# EasyEDA Pro project eLight.eprj

# Schematic SCH
Create Date: 2023-01-14; Page Name: P1; Project Name: FlashLight; Schematic Name: Schematic1; Update Date: 2023-02-02; Company: 嘉立创EDA; Page Size: A4; Version: V1.0
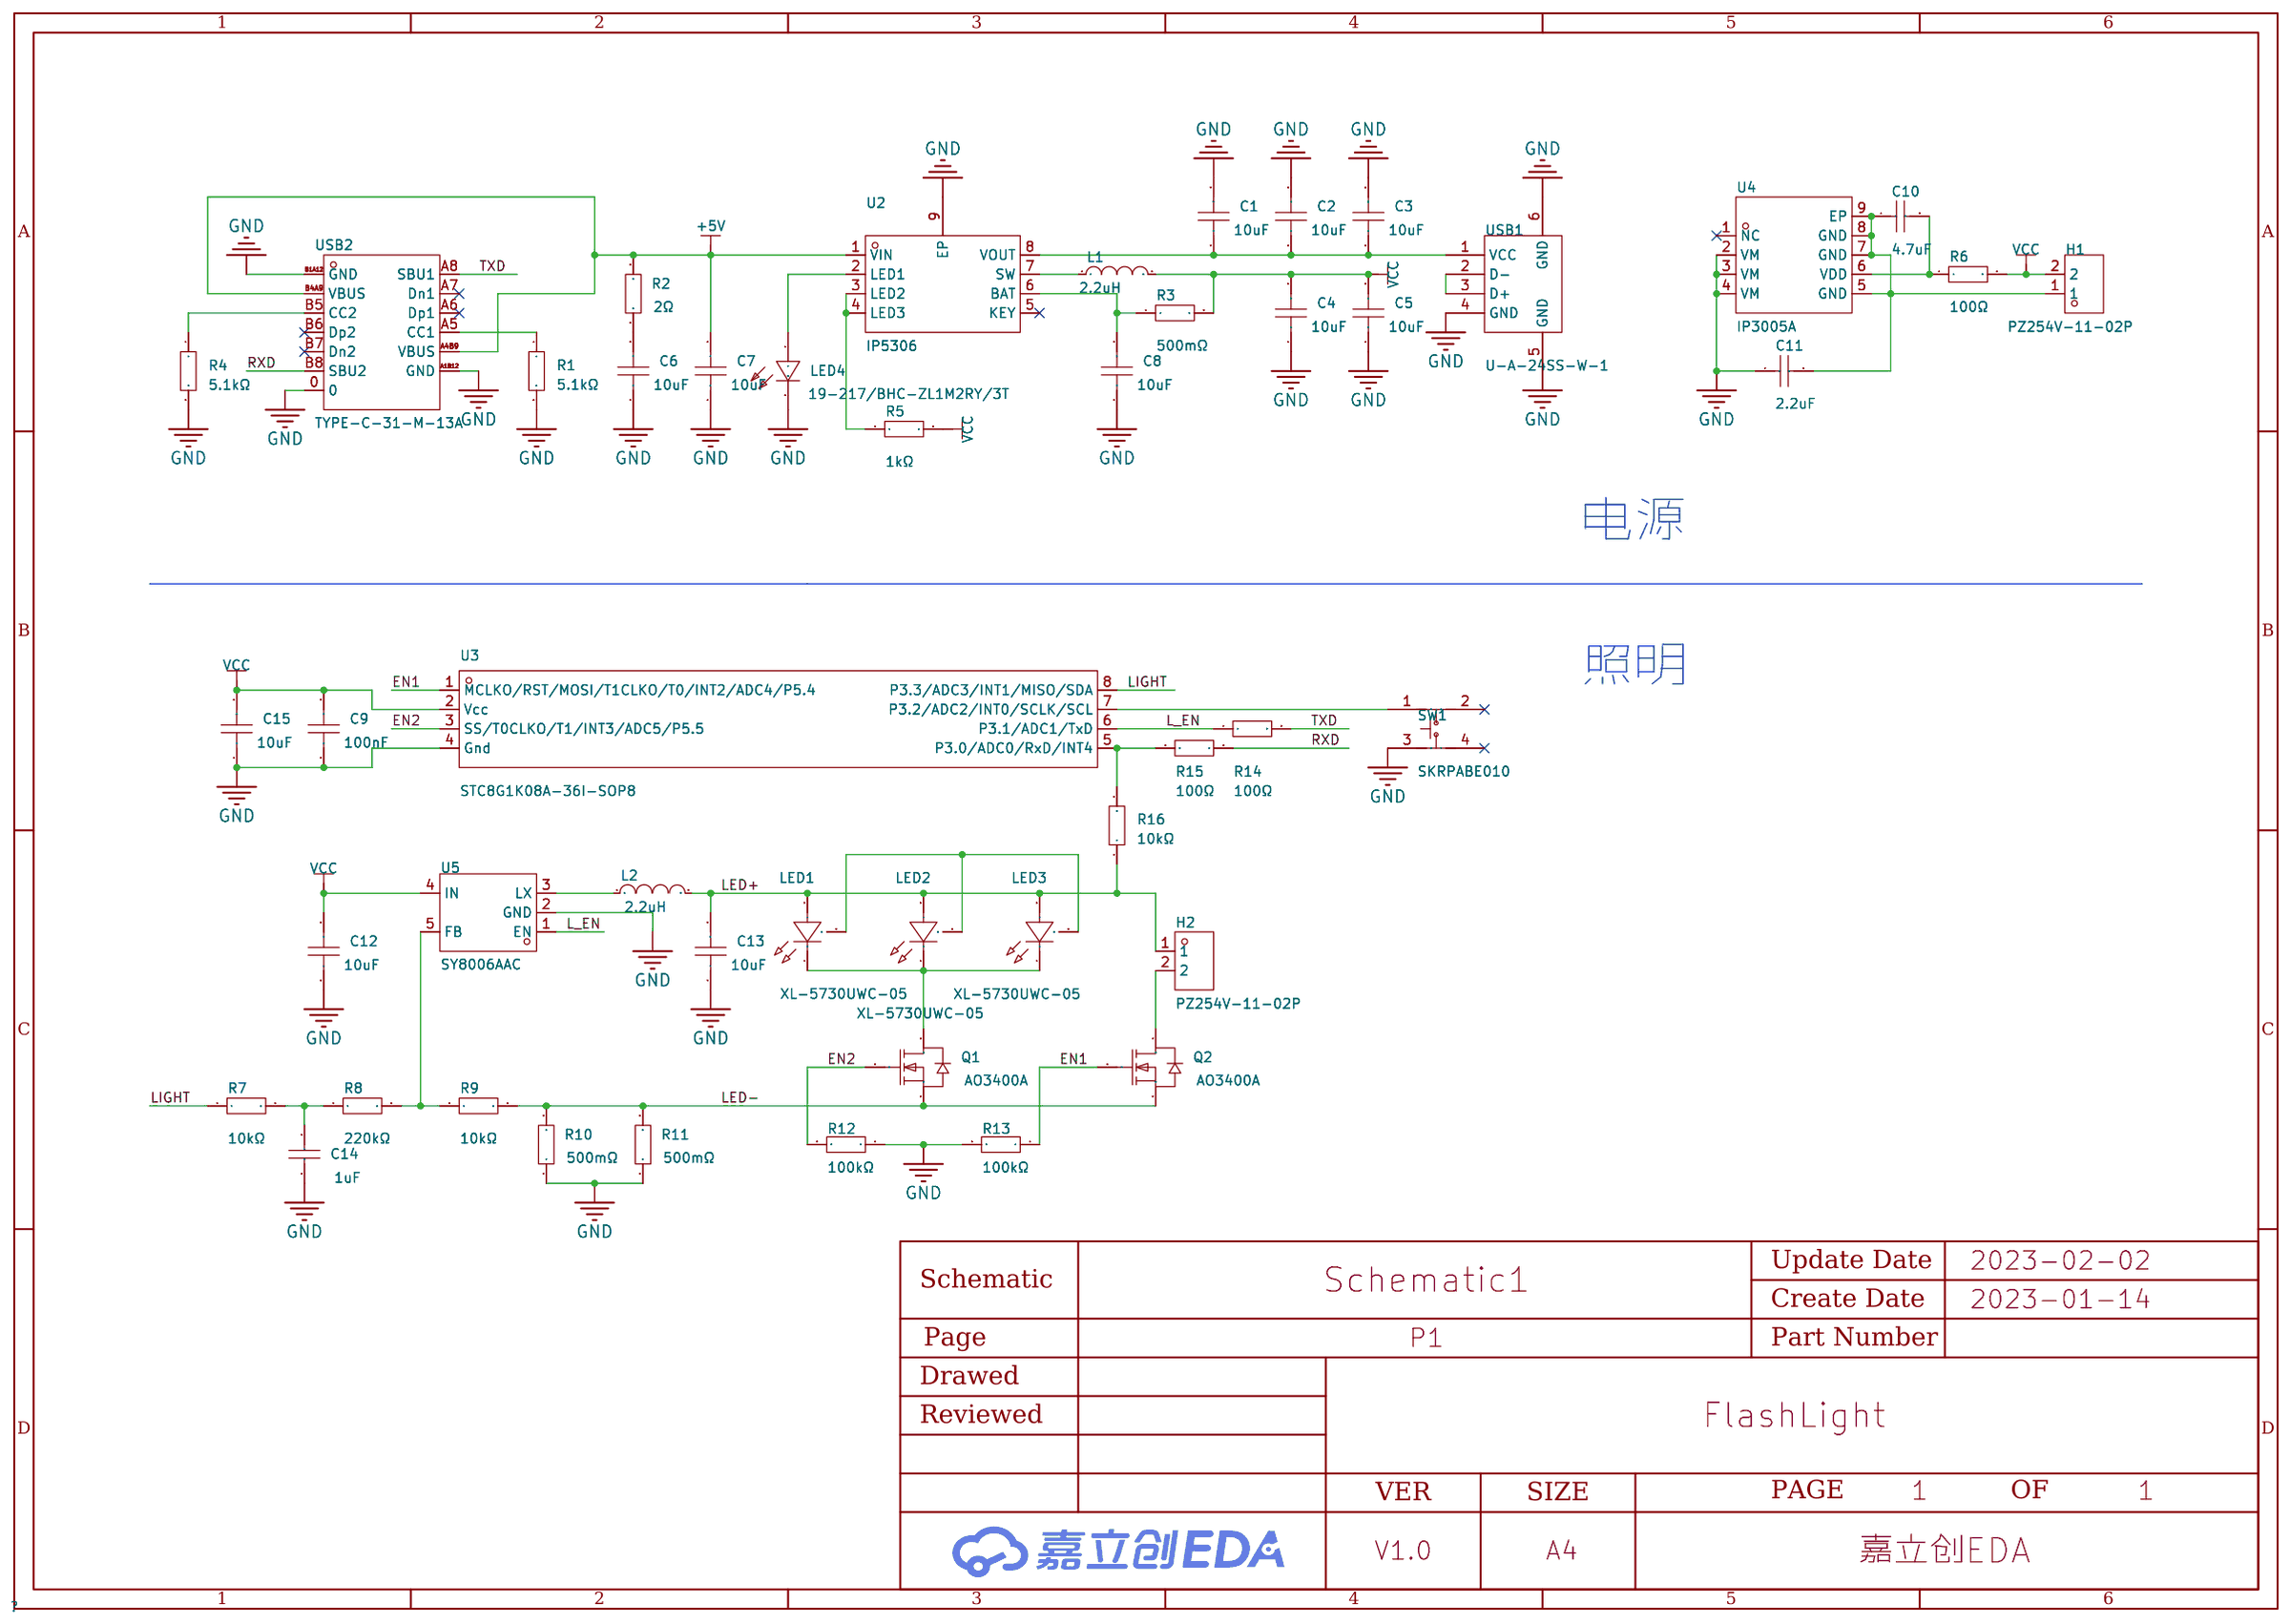
[diagram p0: schematic sheet]

## Parts
C1  10uF  [C0603]
C2  10uF  [C0603]
C3  10uF  [C0603]
C4  10uF  [C0603]
C5  10uF  [C0603]
C6  10uF  [C0603]
C7  10uF  [C0603]
C8  10uF  [C0603]
C9  100nF  [C0603]
C10  4.7uF  [C0603]
C11  2.2uF  [C0603]
C12  10uF  [C0603]
C13  10uF  [C0603]
C14  1uF  [C0603]
C15  10uF  [C0603]
H1  PZ254V-11-02P  [HDR-TH_2P-P2.54-V-M]  (no BOM)
H2  PZ254V-11-02P  [HDR-TH_2P-P2.54-V-M]  (no BOM)
L1  2.2uH  [IND-SMD_L7.3-W6.6]
L2  2.2uH  [IND-SMD_L4.5-W4.0-1]
LED1  XL-5730UWC-05  [LED-SMD_3P-L5.7-W3.0-RD]
LED2  XL-5730UWC-05  [LED-SMD_3P-L5.7-W3.0-RD]
LED3  XL-5730UWC-05  [LED-SMD_3P-L5.7-W3.0-RD]
LED4  19-217/BHC-ZL1M2RY/3T  [LED0603-R-RD_BLUE]
Q1  AO3400A  [SOT-23-3_L2.9-W1.6-P1.90-LS2.8-BR]
Q2  AO3400A  [SOT-23-3_L2.9-W1.6-P1.90-LS2.8-BR]
R1  5.1kΩ  [R0603]
R2  2Ω  [R0603]
R3  500mΩ  [R0603]
R4  5.1kΩ  [R0603]
R5  1kΩ  [R0603]
R6  100Ω  [R0603]
R7  10kΩ  [R0603]
R8  220kΩ  [R0603]
R9  10kΩ  [R0603]
R10  500mΩ  [R0805]
R11  500mΩ  [R0805]
R12  100kΩ  [R0603]
R13  100kΩ  [R0603]
R14  100Ω  [R0603]
R15  100Ω  [R0603]
R16  10kΩ  [R0603]
SW1  SKRPABE010  [KEY-SMD_4P-L4.2-W3.2-P2.20-LS4.6]
U2  IP5306  [ESOP-8_L4.9-W3.9-P1.27-LS6.0-BL-EP]
U3  STC8G1K08A-36I-SOP8  [SOP-8_L5.0-W4.0-P1.27-LS6.0-BL]
U4  IP3005A  [ESOP-8_L4.9-W3.9-P1.27-LS6.0-BL-EP]
U5  SY8006AAC  [SOT-23-5_L3.0-W1.6-P0.95-LS2.8-BR]
USB1  U-A-24SS-W-1  [USB-A-SMD_U-A-24SS-W-1]
USB2  TYPE-C-31-M-13A  [USB-C-SMD_TYPE-C-31-M-13A-1]

## Library data of the parts
C1-C8 C12 C13 C15 = CL10A106KP8NNNC: 容值:10uF;精度:±10%;额定电压:10V;材质(温度系数):X5R;; LCSC Part Name: 10uF ±10% 10V; Supplier Part: C19702; Manufacturer: SAMSUNG(三星); Supplier Footprint: 0603; JLCPCB Part Class: Basic Part; Datasheet: https://atta.szlcsc.com/upload/public/pdf/source/20160103/1457707703378.pdf; Supplier: LCSC; Tolerance: ±10%; Voltage Rated: 10V; Temperature Coefficient: X5R
C9 = CC0603KRX7R9BB104: 容值:100nF;精度:±10%;额定电压:50V;材质(温度系数):X7R;; LCSC Part Name: 100nF ±10% 50V; Supplier Part: C14663; Manufacturer: YAGEO(国巨); Supplier Footprint: 0603; JLCPCB Part Class: Basic Part; Datasheet: https://atta.szlcsc.com/upload/public/pdf/source/20170116/1484561234239.pdf; Supplier: LCSC; Tolerance: ±10%; Voltage Rated: 50V; Temperature Coefficient: X7R
C10 = CL10A475KO8NNNC: 容值:4.7uF;精度:±10%;额定电压:16V;材质(温度系数):X5R;; LCSC Part Name: 4.7uF ±10% 16V; Supplier Part: C19666; Manufacturer: SAMSUNG(三星); Supplier Footprint: 0603; JLCPCB Part Class: Basic Part; Datasheet: https://atta.szlcsc.com/upload/public/pdf/source/20160103/1457707703134.pdf; Supplier: LCSC; Tolerance: ±10%; Voltage Rated: 16V; Temperature Coefficient: X5R
C11 = CL10A225KO8NNNC: 容值:2.2uF;精度:±10%;额定电压:16V;材质(温度系数):X5R;; LCSC Part Name: 2.2uF ±10% 16V; Supplier Part: C23630; Manufacturer: SAMSUNG(三星); Supplier Footprint: 0603; JLCPCB Part Class: Basic Part; Datasheet: https://atta.szlcsc.com/upload/public/pdf/source/20160103/1457707709512.pdf; Supplier: LCSC; Tolerance: ±10%; Voltage Rated: 16V; Temperature Coefficient: X5R
C14 = CL10A105KB8NNNC: 容值:1uF;精度:±10%;额定电压:50V;材质(温度系数):X5R;; LCSC Part Name: 1uF ±10% 50V; Supplier Part: C15849; Manufacturer: SAMSUNG(三星); Supplier Footprint: 0603; JLCPCB Part Class: Basic Part; Datasheet: https://atta.szlcsc.com/upload/public/pdf/source/20160103/1457707679084.pdf; Supplier: LCSC; Tolerance: ±10%; Voltage Rated: 50V; Temperature Coefficient: X5R
H1 H2 = PZ254V-11-02P: 排数:单排;总PIN位数:2;间距:2.54mm;插针结构:1x2P;行距:-;安装类型:直插;圆针/方针:方针;额定电流:-;额定电压:-;配合针长度:6mm;塑高:2.5mm;端接针长度:3mm;触头材质:黄铜;触头镀层:-;工作温度范围:-40℃~+105℃;颜色:黑色;; LCSC Part Name: 2.54mm 1x2P 直插 方针; Supplier Part: C492401; Manufacturer: XFCN(兴飞); Supplier Footprint: 直插,P=2.54mm; JLCPCB Part Class: Extended Part; Datasheet: https://atta.szlcsc.com/upload/public/pdf/source/20200309/C492401_A812433581A9B211A7FFA413ADDFF0E5.pdf; Supplier: LCSC; Number of Rows: 单排; Number of Pins: 2; Pitch: 2.54mm; Pin Structure: 1x2P; Mounting Type: 直插; Circluar Pins/Square Pins: 方针; Length of Mating Pin: 6mm; Insulation Height: 2.5mm; Length of End Connection Pin: 3mm; Contact Material: 黄铜; Operating Temperature Range: -40℃~+105℃; Color: 黑色
L1 = MCS0630-2R2MPY1: 电感值:2.2uH;精度:±20%;额定电流:8A;饱和电流(Isat):12A;直流电阻(DCR):17mΩ;; LCSC Part Name: 2.2uH ±20% 8A 17mΩ; Supplier Part: C2937096; Manufacturer: PSA(信昌电陶); Supplier Footprint: 0630; JLCPCB Part Class: Extended Part; Datasheet: https://atta.szlcsc.com/upload/public/pdf/source/20220121/EA6E6E6F70ED7BAE67EC293805EAAACB.pdf; Supplier: LCSC; Tolerance: ±20%; Rated Current: 8A; Saturation Current (Isat): 12A; DC Resistance (DCR): 17mΩ
L2 = MCS0420-2R2MN2: 电感值:2.2uH;精度:±20%;额定电流:3A;直流电阻(DCR):52mΩ;; LCSC Part Name: 2.2uH ±20% 3A 52mΩ; Supplier Part: C442397; Manufacturer: PSA(信昌电陶); Supplier Footprint: SMD,4x4.6x2mm; JLCPCB Part Class: Extended Part; Supplier: LCSC; Tolerance: ±20%; Rated Current: 3A; DC Resistance (DCR): 52mΩ
LED1-LED3 = XL-5730UWC-05: 发光颜色:白灯;透镜颜色:黄色;色温:6000K~6500K;光通量(25℃时):60lm;测试电流:150mA;正向电压(VF):3.4V;功率:500mW;发光角度:120°;安装方式:正贴;工作温度:-30℃~+85℃;; LCSC Part Name: 白灯 6000K~6500K 正贴; Supplier Part: C2843887; Manufacturer: XINGLIGHT(成兴光); Supplier Footprint: SMD,5.7x3x0.85mm; JLCPCB Part Class: Extended Part; Datasheet: https://atta.szlcsc.com/upload/public/pdf/source/20210707/C2843887_E318470045FDCAD2164A3A593BD4F3D0.pdf; Supplier: LCSC; Emitted Color: 白灯; Lens Color: 黄色; Color Temperature: 6000K~6500K; Luminous Flux (@25℃): 60lm; Forward Current: 150mA; Forward Voltage (VF): 3.4V; Power Dissipation: 500mW; Viewing Angle: 120°; Mounting Sytle: 正贴; Operating Temperature: -30℃~+85℃
LED4 = 19-217/BHC-ZL1M2RY/3T: 照明颜色:蓝色;主波长/色坐标:465~475nm;; LCSC Part Name: 0603 蓝灯; Supplier Part: C72041; Manufacturer: EVERLIGHT(亿光); Supplier Footprint: 0603; JLCPCB Part Class: Basic Part; Datasheet: https://atta.szlcsc.com/upload/public/pdf/source/20170116/1484561237273.pdf; Supplier: LCSC; Mounting Type: 表面贴装; Illumination Color: 蓝色; Luminous Intensity (IF=20mA): 11.5~28.5mcd@5mA; Dominant Wavelength / Coordinate rank: 465~475nm
Q1 Q2 = AO3400A_C20917: 类型:N沟道;漏源电压(Vdss):30V;连续漏极电流(Id):5.7A;功率(Pd):1.4W;导通电阻(RDS(on)@Vgs,Id):26.5mΩ@10V,5.7A;阈值电压(Vgs(th)@Id):1.5V@250uA;; LCSC Part Name: N沟道 30V 5.7A; Supplier Part: C20917; Manufacturer: AOS; Supplier Footprint: SOT-23; JLCPCB Part Class: Basic Part; Datasheet: https://atta.szlcsc.com/upload/public/pdf/source/20140107/1457706668533.pdf; Supplier: LCSC; Type: N沟道; Drain Source Voltage (Vdss): 30V; Continuous Drain Current (Id): 5.7A; Power Dissipation (Pd): 1.4W; Drain Source On Resistance (RDS(on)@Vgs,Id): 26.5mΩ@10V,5.7A; Gate Threshold Voltage (Vgs(th)@Id): 1.5V@250uA
R1 R4 = 0603WAF5101T5E: 电阻类型:厚膜电阻;阻值:5.1kΩ;精度:±1%;功率:100mW;温度系数:±100ppm/℃;最大工作电压:75V;工作温度范围:-55℃~+155℃;; LCSC Part Name: 5.1kΩ ±1% 100mW; Supplier Part: C23186; Manufacturer: UNI-ROYAL(厚声); Supplier Footprint: 0603; JLCPCB Part Class: Basic Part; Datasheet: https://atta.szlcsc.com/upload/public/pdf/source/20200306/C422600_1E6D84923E4A46A82E41ADD87F860B5C.pdf; Supplier: LCSC; Type: 厚膜电阻; Tolerance: ±1%; Power(Watts): 100mW; Temperature Coefficient: ±100ppm/℃; Overload Voltage (Max): 75V; Operating Temperature Range: -55℃~+155℃
R2 = 0603WAF200KT5E: 电阻类型:厚膜电阻;阻值:2Ω;精度:±1%;功率:100mW;温度系数:±400ppm/℃;最大工作电压:75V;工作温度范围:-55℃~+155℃;; LCSC Part Name: 2Ω ±1% 100mW; Supplier Part: C22977; Manufacturer: UNI-ROYAL(厚声); Supplier Footprint: 0603; JLCPCB Part Class: Basic Part; Datasheet: https://atta.szlcsc.com/upload/public/pdf/source/20200306/C422600_1E6D84923E4A46A82E41ADD87F860B5C.pdf; Supplier: LCSC; Type: 厚膜电阻; Tolerance: ±1%; Power(Watts): 100mW; Temperature Coefficient: ±400ppm/℃; Overload Voltage (Max): 75V; Operating Temperature Range: -55℃~+155℃
R3 = 0603WAF500LT5E: 温度系数:±800ppm/℃;精度:±1%;阻值:500mΩ;功率:1/10W;最大工作电压:75V;工作温度范围:-55℃~+155℃;; LCSC Part Name: 0.5Ω ±1%; Supplier Part: C45312; Manufacturer: UNI-ROYAL(厚声); Supplier Footprint: 0603; JLCPCB Part Class: Extended Part; Datasheet: https://atta.szlcsc.com/upload/public/pdf/source/20170920/C45312_1505895340023981421.pdf; Supplier: LCSC; Temperature Coefficient: ±800ppm/℃; Tolerance: ±1%; Power(Watts): 1/10W; Overload Voltage (Max): 75V; Operating Temperature Range: -55℃~+155℃; Type: 厚膜电阻
R5 = 0603WAF1001T5E: 电阻类型:厚膜电阻;阻值:1kΩ;精度:±1%;功率:100mW;温度系数:±100ppm/℃;最大工作电压:75V;工作温度范围:-55℃~+155℃;; LCSC Part Name: 1kΩ ±1% 100mW; Supplier Part: C21190; Manufacturer: UNI-ROYAL(厚声); Supplier Footprint: 0603; JLCPCB Part Class: Basic Part; Datasheet: https://atta.szlcsc.com/upload/public/pdf/source/20200306/C422600_1E6D84923E4A46A82E41ADD87F860B5C.pdf; Supplier: LCSC; Type: 厚膜电阻; Tolerance: ±1%; Power(Watts): 100mW; Temperature Coefficient: ±100ppm/℃; Overload Voltage (Max): 75V; Operating Temperature Range: -55℃~+155℃
R6 R14 R15 = 0603WAF1000T5E: 电阻类型:厚膜电阻;阻值:100Ω;精度:±1%;功率:100mW;温度系数:±200ppm/℃;最大工作电压:75V;工作温度范围:-55℃~+155℃;; LCSC Part Name: 100Ω ±1% 100mW; Supplier Part: C22775; Manufacturer: UNI-ROYAL(厚声); Supplier Footprint: 0603; JLCPCB Part Class: Basic Part; Datasheet: https://atta.szlcsc.com/upload/public/pdf/source/20200306/C422600_1E6D84923E4A46A82E41ADD87F860B5C.pdf; Supplier: LCSC; Type: 厚膜电阻; Tolerance: ±1%; Power(Watts): 100mW; Temperature Coefficient: ±200ppm/℃; Overload Voltage (Max): 75V; Operating Temperature Range: -55℃~+155℃
R7 R9 R16 = 0603WAF1002T5E: 电阻类型:厚膜电阻;阻值:10kΩ;精度:±1%;功率:100mW;温度系数:±100ppm/℃;最大工作电压:75V;工作温度范围:-55℃~+155℃;; LCSC Part Name: 10kΩ ±1% 100mW; Supplier Part: C25804; Manufacturer: UNI-ROYAL(厚声); Supplier Footprint: 0603; JLCPCB Part Class: Basic Part; Datasheet: https://atta.szlcsc.com/upload/public/pdf/source/20200306/C422600_1E6D84923E4A46A82E41ADD87F860B5C.pdf; Supplier: LCSC; Type: 厚膜电阻; Tolerance: ±1%; Power(Watts): 100mW; Temperature Coefficient: ±100ppm/℃; Overload Voltage (Max): 75V; Operating Temperature Range: -55℃~+155℃
R8 = 0603WAF2203T5E: 电阻类型:厚膜电阻;阻值:220kΩ;精度:±1%;功率:100mW;温度系数:±100ppm/℃;最大工作电压:75V;工作温度范围:-55℃~+155℃;; LCSC Part Name: 220kΩ ±1% 100mW; Supplier Part: C22961; Manufacturer: UNI-ROYAL(厚声); Supplier Footprint: 0603; JLCPCB Part Class: Basic Part; Datasheet: https://atta.szlcsc.com/upload/public/pdf/source/20200306/C422600_1E6D84923E4A46A82E41ADD87F860B5C.pdf; Supplier: LCSC; Type: 厚膜电阻; Tolerance: ±1%; Power(Watts): 100mW; Temperature Coefficient: ±100ppm/℃; Overload Voltage (Max): 75V; Operating Temperature Range: -55℃~+155℃
R10 R11 = 0805W8F500LT5E: 电阻类型:厚膜电阻;阻值:500mΩ;精度:±1%;功率:125mW;温度系数:±800ppm/℃;最大工作电压:150V;工作温度范围:-55℃~+155℃;; LCSC Part Name: 500mΩ ±1% 125mW; Supplier Part: C28319; Manufacturer: UNI-ROYAL(厚声); Supplier Footprint: 0805; JLCPCB Part Class: Extended Part; Datasheet: https://atta.szlcsc.com/upload/public/pdf/source/20200306/C422600_1E6D84923E4A46A82E41ADD87F860B5C.pdf; Supplier: LCSC; Type: 厚膜电阻; Tolerance: ±1%; Power(Watts): 125mW; Temperature Coefficient: ±800ppm/℃; Overload Voltage (Max): 150V; Operating Temperature Range: -55℃~+155℃
R12 R13 = 0603WAF1003T5E: 电阻类型:厚膜电阻;阻值:100kΩ;精度:±1%;功率:100mW;温度系数:±100ppm/℃;最大工作电压:75V;工作温度范围:-55℃~+155℃;; LCSC Part Name: 100kΩ ±1% 100mW; Supplier Part: C25803; Manufacturer: UNI-ROYAL(厚声); Supplier Footprint: 0603; JLCPCB Part Class: Basic Part; Datasheet: https://atta.szlcsc.com/upload/public/pdf/source/20200306/C422600_1E6D84923E4A46A82E41ADD87F860B5C.pdf; Supplier: LCSC; Type: 厚膜电阻; Tolerance: ±1%; Power(Watts): 100mW; Temperature Coefficient: ±100ppm/℃; Overload Voltage (Max): 75V; Operating Temperature Range: -55℃~+155℃
SW1 = SKRPABE010: 触点电流:50mA;额定电压(DC):16V;电路结构:单刀单掷;按钮作用方向:顶部触动;致动器样式:椭圆形按钮;照明颜色:-;开关长度:4.2mm;开关宽度:3.2mm;开关高度:2.5mm;; LCSC Part Name: 3.2*4.2*2.5，1.57N; Supplier Part: C115360; Manufacturer: ALPSALPINE(阿尔卑斯阿尔派); Supplier Footprint: SMD; JLCPCB Part Class: Extended Part; Datasheet: https://atta.szlcsc.com/upload/public/pdf/source/20170620/1497944816225.pdf; Supplier: LCSC; Contact Current: 50mA; Voltage Rating (DC): 16V; Circuit: 单刀单掷; Actuator Orientation: 顶部触动; Actuator Style: 椭圆形按钮; Switch Length: 4.2mm; Switch Width: 3.2mm; Switch Height: 2.5mm
U2 = IP5306: 2.1A充电2.4A放电高集成度移动电源SOC; Supplier Part: C181692; Manufacturer: INJOINIC(英集芯); Supplier Footprint: ESOP-8; JLCPCB Part Class: Extended Part; Datasheet: https://atta.szlcsc.com/upload/public/pdf/source/20180920/C181692_842C9BF636DF123BB66E91FC1AD6F13F.pdf; Supplier: LCSC
U3 = STC8G1K08A-36I-SOP8: CPU内核:51系列;CPU最大主频:-;工作电压范围:1.9V~5.5V;内部振荡器:有;外部时钟频率范围:-;程序 FLASH容量:8KB;RAM总容量:1.25KB;EEPROM/数据 FLASH容量:4KB;GPIO端口数量:6;ADC(单元数/通道数/位数):1@x6ch/10bit;DAC(单元数/通道数/位数):-;(E)PWM(单元数/通道数/位数):-;8位Timer数量:-;16位Timer数量:2;32位Timer数量:-;内部比较器数量:-;U(S)ART路数:1;I2C路数:1;; LCSC Part Name: 51系列 闪存：8KB RAM：1.25KB; Supplier Part: C915663; Manufacturer: STC(宏晶); Supplier Footprint: SOP-8-4.0mm; JLCPCB Part Class: Extended Part; Datasheet: https://atta.szlcsc.com/upload/public/pdf/source/20201105/C713818_1666C7558605C197DBF08446D241F69F.pdf; Supplier: LCSC; CPU Core: 51系列; Supply Voltage Range: 1.9V~5.5V; Internal Oscillator: 有; Program FLASH Size: 8KB; RAM Size: 1.25KB; EEPROM/Data FLASH Size: 4KB; GPIO Ports Number: 6; ADC (Units/Channels/bits): 1@x6ch/10bit; 16Bit Timer Number: 2; U(S)ART Number: 1; I2C Number: 1; (Q)SPI Number: 1; Peripherals / Functions / Protocol Stacks: 低电压检测；看门狗；CCP捕获/比较；除法器；乘法器; Operating Temperature Range: -40℃~+85℃
U4 = IP3005A: 过充电压:4.28V,过充恢复电压:4.1V,高精度内置MOSFET单节锂电池保护IC; Supplier Part: C181685; Manufacturer: INJOINIC(英集芯); Supplier Footprint: ESOP-8; JLCPCB Part Class: Extended Part; Datasheet: https://atta.szlcsc.com/upload/public/pdf/source/20181019/C181685_8FCD62B90ABBC24A3EFF28CA6DF89AAB.pdf; Supplier: LCSC
U5 = SY8006AAC: Supplier Part: C207635; Manufacturer: silergy(矽力杰); Supplier Footprint: SOT-23-5; JLCPCB Part Class: Extended Part; Datasheet: https://atta.szlcsc.com/upload/public/pdf/source/20220426/6B77E4D9F50C5AD910D0E0C02879B237.pdf; Supplier: LCSC
USB1 = U-A-24SS-W-1: 连接器类型:Type-A;标准:USB 2.0;公母:母座;触点数量:4;端口数量:1;额定电流 - 电源:-;; LCSC Part Name: Type-A 母座; Supplier Part: C283549; Manufacturer: 韩国韩荣; Supplier Footprint: SMD; JLCPCB Part Class: Extended Part; Datasheet: https://atta.szlcsc.com/upload/public/pdf/source/20210810/644547C8310925CF75989C506044338C.pdf; Supplier: LCSC; Connector Type: Type-A; Standard: USB 2.0; Gender: 母座; Number of Contacts: 4; Number of Ports: 1
USB2 = TYPE-C-31-M-13A: Supplier Part: C2848618; Manufacturer: 韩国韩荣; Supplier Footprint: SMD; JLCPCB Part Class: Extended Part; Datasheet: https://atta.szlcsc.com/upload/public/pdf/source/20210810/CADD14FCE49A6F546FAC1DBB2463226E.pdf; Supplier: LCSC

## Nets
+5V: C7.2 R2.2 U2.1(VIN) USB2.A4B9(VBUS) USB2.B4A9(VBUS)
GND: C1.2 C2.2 C3.2 C4.1 C5.1 C6.1 C7.1 C8.1 C9.1 C11.1 C12.1 C13.1 C14.1 C15.1 LED4.2(C) R1.2 R4.2 R10.1 R11.1 R12.1 R13.2 SW1.3 U2.9(EP) U3.4(Gnd) U4.2(VM) U4.3(VM) U4.4(VM) U5.2(GND) USB1.4(GND) USB1.5(GND) USB1.6(GND) USB2.0 USB2.A1B12(GND) USB2.B1A12(GND)
VCC: C4.2 C5.2 C9.2 C12.2 C15.2 H1.2 L1.2 R3.2 R5.2 R6.2 U3.2(Vcc) U5.4(IN)
EN1: Q2.1(G) R13.1 U3.1(MCLKO/RST/MOSI/T1CLKO/T0/INT2/ADC4/P5.4)
EN2: Q1.1(G) R12.2 U3.3(SS/T0CLKO/T1/INT3/ADC5/P5.5)
L_EN: R14.1 U3.6(P3.1/ADC1/TxD) U5.1(EN)
LED+: C13.2 H2.1 L2.2 LED1.2(A) LED2.2(A) LED3.2(A) R16.1
LED-: Q1.2(S) Q2.2(S) R9.2 R10.2 R11.2
LIGHT: R7.1 U3.8(P3.3/ADC3/INT1/MISO/SDA)
RXD: R15.2 USB2.B8(SBU2)
TXD: R14.2 USB2.A8(SBU1)
$1N2935: SW1.1 U3.7(P3.2/ADC2/INT0/SCLK/SCL)
$1N3190: L2.1 U5.3(LX)
$1N3207: LED1.1(K) LED2.1(K) LED3.1(K) Q1.3(D)
$1N3392: R8.2 R9.1 U5.5(FB)
$1N3897: C14.2 R7.2 R8.1
$1N4848: LED1.3 LED2.3 LED3.3
$1N7267: H2.2 Q2.3(D)
$1N7416: R5.1 U2.3(LED2) U2.4(LED3)
$1N7437: LED4.1(A) U2.2(LED1)
$1N8097: L1.1 U2.7(SW)
$1N8220: C1.1 C2.1 C3.1 U2.8(VOUT) USB1.1(VCC)
$1N8237: USB1.2(D-) USB1.3(D+)
$1N8507: C6.2 R2.1
$1N9740: C8.2 R3.1 U2.6(BAT)
$1N13209: C10.2 R6.1 U4.6(VDD)
$1N13243: C10.1 C11.2 H1.1 U4.5(GND) U4.7(GND) U4.8(GND) U4.9(EP)
$1N21017: R1.1 USB2.A5(CC1)
$1N21224: R4.1 USB2.B5(CC2)
$1N31643: R15.1 R16.2 U3.5(P3.0/ADC0/RxD/INT4)

Not connected (* = marked no-connect by the designer): SW1 2* 4*; U2 5(KEY)*; U4 1(NC)*; USB2 A6(Dp1)* A7(Dn1)* B6(Dp2)* B7(Dn2)*

## Notes on the sheet
- 电源
- 照明

# Board PCB
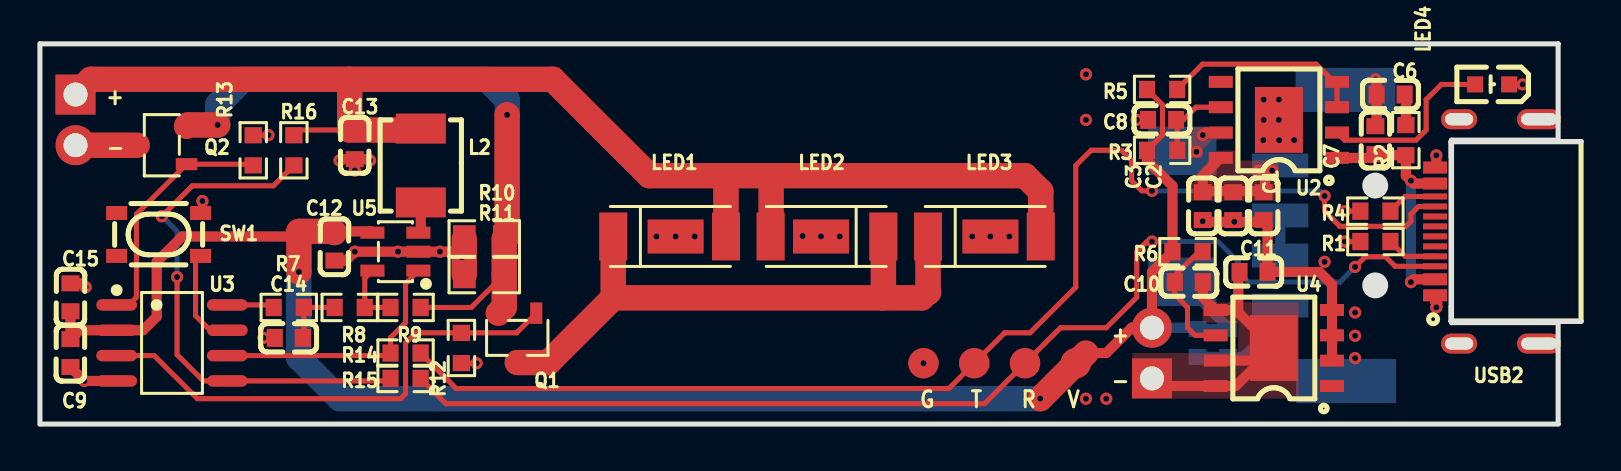
[diagram p1: board, top side]
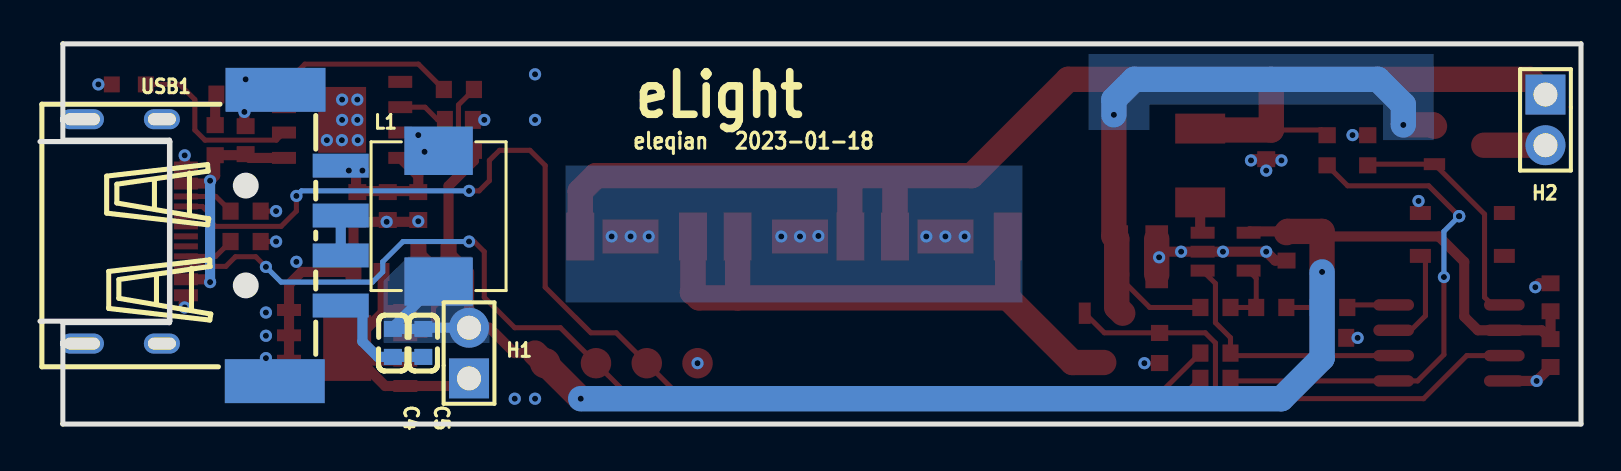
[diagram p2: board, bottom side, seen from below]

Outline 77.09 x 19.05 mm; copper layers: Top Layer, Bottom Layer. Coordinates in mm from the lower left corner of the outline.
Outline path: 0,19.05 0,0 75.95,0 75.95,5.08 70.61,5.08 70.61,14.22 75.95,14.22 75.95,19.05 0,19.05
Stack: Top Layer 0.035mm / Dielectric1 0.91mm FR4 er 4.5 / Bottom Layer 0.035mm

## Design rules (mm)
spacing safeClearance (default): track to track 0.152, other pairs 0.152 to 0.3
track width trackWidth (default): min 0.127, default 0.254, max 2.54
differential pair differentialPair (default): width min 0.127, default 0.254, max 2.54; gap min 0.152, default 0.152
via viaSize (default): diameter min 0.5, default 0.61, max 10; hole min 0.3, default 0.305, max 6
net GND uses copperRegion1
net $1N13243 uses copperRegion1
net $1N3207 uses copperRegion1
net LED+ uses copperRegion1

## Placement (name value [footprint] x y rotation side)
C1  10uF  [C0603]  61.21 10.92 270 top
C2  10uF  [C0603]  59.69 10.92 270 top
C3  10uF  [C0603]  58.17 10.92 270 top
C4  10uF  [C0603]  59.44 4.06 90 bottom
C5  10uF  [C0603]  57.91 4.06 90 bottom
C6  10uF  [C0603]  67.56 16.51 0 top
C7  10uF  [C0603]  66.8 14.22 270 top
C8  10uF  [C0603]  56.13 15.24 0 top
C9  100nF  [C0603]  1.52 3.56 90 top
C10  4.7uF  [C0603]  57.47 7.11 180 top
C11  2.2uF  [C0603]  60.71 7.62 180 top
C12  10uF  [C0603]  14.73 8.89 90 top
C13  10uF  [C0603]  15.75 13.97 90 top
C14  1uF  [C0603]  12.45 4.32 0 top
C15  10uF  [C0603]  1.52 6.35 270 top
H1  PZ254V-11-02P  [HDR-TH_2P-P2.54-V-M]  55.63 3.56 90 bottom
H2  PZ254V-11-02P  [HDR-TH_2P-P2.54-V-M]  1.78 15.24 270 bottom
L1  2.2uH  [IND-SMD_L7.3-W6.6]  57.15 10.41 90 bottom
L2  2.2uH  [IND-SMD_L4.5-W4.0-1]  19.05 12.95 90 top
LED1  XL-5730UWC-05  [LED-SMD_3P-L5.7-W3.0-RD]  31.5 9.4 0 top
LED2  XL-5730UWC-05  [LED-SMD_3P-L5.7-W3.0-RD]  39.37 9.4 180 top
LED3  XL-5730UWC-05  [LED-SMD_3P-L5.7-W3.0-RD]  47.24 9.4 0 top
LED4  19-217/BHC-ZL1M2RY/3T  [LED0603-R-RD_BLUE]  72.64 17.02 180 top
NOREF  -  [Pad_e2023]  51.82 3.05 0 top
NOREF#2  -  [Pad_e660]  46.74 3.05 0 top
NOREF#3  -  [Pad_e664]  44.2 3.05 0 top
NOREF#4  -  [Pad_e663]  49.28 3.05 0 top
Q1  AO3400A  [SOT-23-3_L2.9-W1.6-P1.90-LS2.8-BR]  23.88 4.32 90 top
Q2  AO3400A  [SOT-23-3_L2.9-W1.6-P1.90-LS2.8-BR]  6.1 13.97 0 top
R1  5.1kΩ  [R0603]  66.8 9.14 180 top
R2  2Ω  [R0603]  68.33 14.22 270 top
R3  500mΩ  [R0603]  56.13 13.72 180 top
R4  5.1kΩ  [R0603]  66.8 10.67 180 top
R5  1kΩ  [R0603]  56.13 16.76 180 top
R6  100Ω  [R0603]  57.4 8.64 180 top
R7  10kΩ  [R0603]  12.45 5.84 0 top
R8  220kΩ  [R0603]  15.49 5.84 0 top
R9  10kΩ  [R0603]  18.29 5.84 0 top
R10  500mΩ  [R0805]  22.22 9.27 0 top
R11  500mΩ  [R0805]  22.22 7.49 0 top
R12  100kΩ  [R0603]  21.08 3.81 90 top
R13  100kΩ  [R0603]  10.67 13.72 90 top
R14  100Ω  [R0603]  18.29 3.56 0 top
R15  100Ω  [R0603]  18.29 2.29 0 top
R16  10kΩ  [R0603]  12.7 13.72 270 top
SW1  SKRPABE010  [KEY-SMD_4P-L4.2-W3.2-P2.20-LS4.6]  5.94 9.5 180 top
U2  IP5306  [ESOP-8_L4.9-W3.9-P1.27-LS6.0-BL-EP]  61.98 15.24 90 top
U3  STC8G1K08A-36I-SOP8  [SOP-8_L5.0-W4.0-P1.27-LS6.0-BL]  6.6 4.06 270 top
U4  IP3005A  [ESOP-8_L4.9-W3.9-P1.27-LS6.0-BL-EP]  61.72 3.81 90 top
U5  SY8006AAC  [SOT-23-5_L3.0-W1.6-P0.95-LS2.8-BR]  17.78 8.64 0 top
USB1  U-A-24SS-W-1  [USB-A-SMD_U-A-24SS-W-1]  63.69 9.45 270 bottom
USB2  TYPE-C-31-M-13A  [USB-C-SMD_TYPE-C-31-M-13A-1]  72.39 9.65 90 top

## Footprints (pads in the part's own frame, mm; a bottom-side part is the same pattern mirrored in y, then rotated)
C0603
  rect 0.8x0.9 smd: 1(-0.7,0) 2(0.7,0)
ESOP-8_L4.9-W3.9-P1.27-LS6.0-BL-EP
  rect 0.6x1.2 smd: 1(-1.905,-2.909) 2(-0.635,-2.909) 3(0.635,-2.909) 4(1.905,-2.909) 5(1.905,2.909) 6(0.635,2.909) 7(-0.635,2.909) 8(-1.905,2.909)
  rect 3.3x2.4 smd: 9(0,0)
HDR-TH_2P-P2.54-V-M
  rect 2x2 hole 1.2: 1(-1.27,0)
  round 2 hole 1.2: 2(1.27,0)
IND-SMD_L4.5-W4.0-1
  rect 1.5x2.5 smd: 1(-1.85,0) 2(1.85,0)
IND-SMD_L7.3-W6.6
  rect 2.424x3.42 smd: 1(3.278,0) 2(-3.278,0)
KEY-SMD_4P-L4.2-W3.2-P2.20-LS4.6
  rect 1.05x0.7 smd: 1(-2.1,1.075) 2(2.1,1.075) 3(-2.1,-1.075) 4(2.1,-1.075)
LED0603-R-RD_BLUE
  rect 0.8x0.8 smd: 1(0.851,0) 2(-0.851,0)
LED-SMD_3P-L5.7-W3.0-RD
  rect 1.4x2.4 smd: 1(-2.82,0) 2(2.82,0)
  rect 2.8x1.7 smd: 3(0.3,0)
Pad_e660
  round 1.524 smd: 1(0,0)
Pad_e663
  round 1.524 smd: 1(0,0)
Pad_e664
  round 1.524 smd: 1(0,0)
Pad_e2023
  round 1.524 smd: 1(0,0)
R0603
  rect 0.806x0.864 smd: 1(-0.753,0) 2(0.753,0)
R0805
  rect 1.133x1.377 smd: 1(-1,0) 2(1,0)
SOP-8_L5.0-W4.0-P1.27-LS6.0-BL
  oval 0.574x2.035 smd: 1(-1.905,-2.768) 2(-0.635,-2.768) 3(0.635,-2.768) 4(1.905,-2.768) 5(1.905,2.768) 6(0.635,2.768) 7(-0.635,2.768) 8(-1.905,2.768)
SOT-23-3_L2.9-W1.6-P1.90-LS2.8-BR
  rect 1.07x0.6 smd: 1(1.235,-0.95) 2(1.235,0.95) 3(-1.235,0)
SOT-23-5_L3.0-W1.6-P0.95-LS2.8-BR
  rect 1.2x0.6 smd: 1(1.15,-0.95) 2(1.15,0) 3(1.15,0.95) 4(-1.15,0.95) 5(-1.15,-0.95)
USB-A-SMD_U-A-24SS-W-1
  rect 1.2x2.8 smd: 1(-3.5,1.65) 2(-1,1.65) 3(1,1.65) 4(3.51,1.65)
  rect 2.2x5 smd: 5(7.3,-1.65) 6(-7.3,-1.613)
USB-C-SMD_TYPE-C-31-M-13A-1
  oval 1x1.8 hole 0.6x1.4: 0(-5.62,1.4) 0(5.62,1.4)
  oval 1x2.2 hole 0.6x1.8: 0(-5.62,-2.6) 0(5.62,-2.6)
  rect 0.6x1.2 smd: A1B12(-3.2,2.6) A4B9(-2.4,2.6) B1A12(3.2,2.6) B4A9(2.4,2.6)
  rect 0.3x1.2 smd: A5(-1.25,2.6) A6(-0.25,2.6) A7(0.25,2.6) A8(1.25,2.6) B5(1.75,2.6) B6(0.75,2.6) B7(-0.75,2.6) B8(-1.75,2.6)

## Nets
As in the schematic, except:
GND: C1.2 C2.2 C3.2 C4.1 C5.1 C6.1 C7.1 C8.1 C9.1 C11.1 C12.1 C13.1 C14.1 C15.1 LED4.2 NOREF#3.1 R1.2 R4.2 R10.1 R11.1 R12.1 R13.2 SW1.3 U2.9 U3.4 U4.2 U4.3 U4.4 U5.2 USB1.4 USB1.5 USB1.6 USB2.0 USB2.A1B12 USB2.B1A12
VCC: C4.2 C5.2 C9.2 C12.2 C15.2 H1.2 L1.2 NOREF.1 R3.2 R5.2 R6.2 U3.2 U5.4
RXD: NOREF#4.1 R15.2 USB2.B8
TXD: NOREF#2.1 R14.2 USB2.A8

Pads without a net: SW1 2 4; U2 5; U4 1; USB2 A6 A7 B6 B7

## Via types
v1: diameter 0.61, hole 0.305, Top Layer to Bottom Layer, 65 vias

## Routing (per net, layer and track width the routed paths; a pad name or vN(x,y) marks a point on that pad's centre or on a via; arc(x,y) is an arc through that point)
+5V: length 12.4
  Top Layer w0.508: v1(68.58,7.11) 68.72,7.25 69.74,7.25 ; 69.74,12.05 68.72,12.05 v1(68.58,12.19) 68.33,12.45 R2.2 66.75,13.47 66.61,13.33 64.9,13.33
  Bottom Layer w0.508: v1(68.58,12.19) v1(68.58,7.11)
GND: length 44.3
  Top Layer w0.254: SW1.3 8.04,11.08 v1(8.13,11.18) ; R4.2 v1(65.28,10.67) ; R1.2 v1(65.28,9.14) ; v1(21.84,3.05) 21.84,3.04 21.1,3.04 R12.1 ; v1(11.43,14.48) 11.42,14.47 R13.2 ; C8.1 v1(54.86,15.24) ; v1(11.18,4.32) C14.1 ; LED4.2 v1(74.17,17.02)
  Top Layer w0.508: U3.4 v1(2.22,2.16) C9.1 ; 61.12,10.13 C1.2 ; 61.12,10.13 v1(59.75,10.13) 58.19,10.13 v1(58.17,10.16) ; 61.12,10.13 61.24,10.13 61.41,9.97 C11.1 64.01,7.62 64.63,7 U4.4 U4.3 U4.2 ; USB2.B1A12 69.87,12.93 69.85,12.95 v1(69.85,13.46) ; C7.1 66.86,14.99 v1(66.86,15.64) C6.1 66.86,17.21 v1(66.8,17.27) ; 21.22,8.64 v1(20,8.64) U5.2 v1(17.91,8.64) v1(15.75,8.64) 15.3,8.19 C12.1 ; v1(14.99,13.21) 15.05,13.27 C13.1 ; C13.1 v1(15.75,12.7) ; C13.1 16.45,13.27 v1(16.51,13.21) ; C15.1 2.09,7.05 v1(2.29,6.86) ; USB2.A1B12 69.79,6.16 69.9,6.05 69.9,5.89 v1(69.85,5.84)
  Top Layer w1.27: R11.1 R10.1
  Bottom Layer w0.508: v1(66.86,15.64) 66.86,15.69 66.8,15.75 ; v1(66.8,17.27) 65.83,17.27 USB1.6 ; USB1.4 61.31,5.94 60.96,5.59 60.96,4.13 60.19,3.36 C4.1 C5.1
  vias: v1(21.11,8.35) v1(44.2,3.05) v1(52.32,17.52) v1(52.32,15.24) v1(52.32,1.27) v1(53.34,1.27) v1(61.21,16.26) v1(61.21,15.24) v1(61.19,14.22) v1(61.98,16.26) v1(61.98,15.24) v1(61.99,14.22) v1(62.74,14.22) v1(64.26,8.13) v1(65.79,5.59) v1(65.79,4.42) v1(65.79,3.3)
VCC: length 92.4
  Top Layer w0.254: R5.2 56.15,15.99 56.15,14.49 R3.2
  Top Layer w0.508: R3.2 55.38,13.2 56.65,11.93 R6.2 55.63,7.61 H1.2 54.61,4.83 53.34,3.56 52.32,3.56 ; C12.2 14.79,9.65 16.56,9.65 U5.4 ; C15.2 C9.2 1.97,4.7 U3.2 5.16,4.7 5.84,5.38 5.84,8.13 7.11,9.4 12.7,9.4 12.95,9.65
  Top Layer w1.27: v1(12.95,7.62) 12.95,9.65 14.67,9.65 C12.2 ; v1(50.04,1.27) 52.32,3.56
  Bottom Layer w0.508: L1.2 59.44,4.85 C4.2 C5.2 57.85,4.83 H1.2
  Bottom Layer w1.27: v1(50.04,1.27) 14.99,1.27 12.95,3.3 v1(12.95,7.62)
EN1: length 12.2
  Top Layer w0.254: R13.1 10.61,13.02 Q2.1 4.83,10.52 4.83,6.35 4.45,5.97 U3.1
EN2: length 25.1
  Top Layer w0.254: Q1.1 23.84,4.57 18.8,4.57 18.29,4.06 18.29,1.52 18.03,1.27 7.87,1.27 5.72,3.43 3.84,3.43
L_EN: length 12.9
  Top Layer w0.254: 9.37,3.43 17.41,3.43 R14.1 17.53,4.33 18.29,5.08 18.29,7.04 U5.1
LED+: length 68.3
  Top Layer w0.254: R16.1 12.96,14.73 15.49,14.73
  Top Layer w1.27: 36.58,12.45 36.58,9.42 LED2.2 ; 36.58,12.45 34.32,12.45 ; 36.58,12.45 49.28,12.45 50.06,11.66 LED3.2 ; 15.49,17.27 2.54,17.27 H2.1 ; 15.49,17.27 15.49,14.73 18.98,14.73 L2.2 ; 15.49,17.27 25.65,17.27 30.48,12.45 34.32,12.45 ; 34.32,12.45 LED1.2
LED-: length 33.5
  Top Layer w0.254: 19.3,5.84 21.57,5.84 R11.2
  Top Layer w1.27: v1(23.37,15.49) 23.37,9.41 R10.2 R11.2 23.22,5.85 Q1.2 ; Q2.2 7.4,14.99 v1(8.89,14.99)
  Bottom Layer w1.27: v1(8.89,14.99) 8.89,16 10.16,17.27 22.35,17.27 23.37,16.26 v1(23.37,15.49)
LIGHT: length 2.6
  Top Layer w0.254: U3.8 11.82,5.97 11.95,5.84
RXD: length 57.8
  Top Layer w0.254: v1(55.63,9.14) 55.37,9.14 54.86,8.64 54.86,6.35 53.34,4.83 51.05,4.83 NOREF#4.1 47.24,1.02 20.31,1.02 R15.2 ; USB2.B8 67.79,7.9 67.31,8.38 66.29,8.38 v1(65.79,7.87)
  Bottom Layer w0.254: v1(65.79,7.87) 65.02,7.11 60.45,7.11 59.94,7.62 59.94,8.13 58.93,9.14 v1(55.63,9.14)
TXD: length 63.2
  Top Layer w0.254: USB2.A8 68.96,10.9 68.58,10.52 68.58,10.16 68.33,9.91 65.02,9.91 64.26,10.67 v1(64.26,11.43) ; v1(55.63,11.68) 55.12,11.68 54.61,12.19 54.61,13.21 54.1,13.72 52.58,13.72 51.82,12.95 51.82,6.86 49.53,4.57 48.26,4.57 NOREF#2.1 45.47,1.78 20.82,1.78 R14.2
  Bottom Layer w0.254: v1(64.26,11.43) 64.01,11.68 v1(55.63,11.68)
$1N2935: length 5
  Top Layer w0.254: U3.7 8.51,4.7 7.78,5.43 7.78,8.17 SW1.1
$1N3190: length 1.6
  Top Layer w0.508: U5.3 19.05,9.71 L2.1
$1N3207: length 31
  Top Layer w1.27: 28.68,6.32 LED1.1 ; 28.68,6.32 25.44,3.08 Q1.3 ; 28.68,6.32 42.19,6.32 ; LED3.1 44.42,6.63 44.45,6.6 44.4,6.6 44.12,6.32 42.19,6.32 ; 42.19,6.32 LED2.1
$1N3392: length 3.3
  Top Layer w0.254: R9.1 R8.2 16.25,7.3 U5.5
$1N3897: length 3.1
  Top Layer w0.254: R8.1 R7.2 13.2,4.37 C14.2
$1N4848:
  vias: v1(30.83,9.4) v1(31.8,9.4) v1(32.75,9.4) v1(38.15,9.42) v1(39.07,9.4) v1(40.01,9.4) v1(46.64,9.4) v1(47.54,9.4) v1(48.49,9.4)
$1N7267: length 3.1
  Top Layer w1.27: H2.2 Q2.3
$1N7416: length 10.2
  Top Layer w0.254: 64.88,16.99 63.84,18.03 58.16,18.03 R5.1 ; 64.88,16.99 U2.4 ; 64.88,16.99 U2.3
$1N7437: length 9.1
  Top Layer w0.254: LED4.1 70.1,17.02 69.34,16.26 69.34,14.73 68.83,14.22 65.27,14.22 64.88,14.61
$1N8097: length 2.3
  Top Layer w0.508: 59.07,14.61 58.29,14.61 v1(58.17,14.48)
  Bottom Layer w0.508: v1(58.17,14.48) 57.38,13.69 L1.1
  vias: v1(57.85,13.64)
$1N8220: length 7.7
  Top Layer w0.508: U2.8 58.17,12.43 58.17,11.67 61.28,11.67 61.28,12.7 v1(60.96,12.7)
  Bottom Layer w0.508: USB1.1 61.21,12.95 v1(60.96,12.7)
  vias: v1(61.64,12.7)
$1N8237: length 2
  Bottom Layer w0.508: USB1.2 USB1.3
$1N8507: length 1.6
  Top Layer w0.508: C6.2 68.33,16.45 R2.1
$1N9740: length 4
  Top Layer w0.254: R3.1 56.89,15.19 C8.2 57.19,15.24 57.83,15.88 U2.6
$1N13209: length 6.1
  Top Layer w0.254: U4.6 57.78,4.44 57.4,4.83 57.4,5.84 56.77,6.48 56.77,7.43 57.9,8.57 57.9,8.64
$1N13243: length 16.7
  Top Layer w0.508: H1.1 56.01,1.91 U4.8 59.82,1.91 61.09,3.17 ; C10.1 58.17,6.35 58.8,5.72 U4.5 59.82,5.72 59.94,5.59 ; U4.7 61.09,3.17 ; 61.09,3.17 U4.9 59.94,5.59 ; 59.94,5.59 59.94,7.62
$1N21017: length 2.5
  Top Layer w0.254: R1.1 68.3,8.4 USB2.A5
$1N21224: length 2.5
  Top Layer w0.254: USB2.B5 68.29,11.4 R4.1
$1N31643: length 26.2
  Top Layer w0.254: v1(6.1,10.41) 7.62,11.94 11.68,11.94 R16.2 ; R15.1 17.41,2.16 U3.5 8.18,2.16 6.86,3.48 v1(6.86,7.37)
  Bottom Layer w0.254: v1(6.1,10.41) 6.86,9.65 v1(6.86,7.37)

## Copper pours and planes (outline as drawn; the poured copper is in the pictures)
GND on Top Layer: 51.82,19.05 75.95,19.05 75.95,0 51.82,0
GND on Bottom Layer: 0,19.05 75.95,19.05 75.95,0 0,0
VCC on Bottom Layer: 54.61,8.39 59.89,8.39 59.89,4.06 54.61,4.06
LED+ on Top Layer: 25.65,10.41 51.05,10.41 51.05,19.05 0,19.05 0,16.76 25.65,16.76
LED- on Bottom Layer: 7.37,18.54 24.64,18.54 24.64,14.22 7.37,14.22
$1N3207 on Top Layer: 25.65,8.13 51.05,8.13 51.05,2.03 25.65,2.03
$1N4848 on Bottom Layer: 27.94,12.95 50.8,12.95 50.8,6.1 27.94,6.1
$1N8097 on Top Layer: 57.54,14.91 59.67,14.91 59.67,13.32 57.54,13.32
$1N8220 on Top Layer: 57.55,13.72 61.98,13.72 61.98,11.18 57.55,11.18
$1N13243 on Top Layer: 54.61,6.11 62.98,6.11 62.98,1.27 54.61,1.27

Small or netless copper shapes (teardrops, artwork), in the pictures only: 1 on Bottom Layer

## Text on the board
Bottom Silkscreen Layer: 2023-01-18 | eleqian | eLight
Top Silkscreen Layer: + | - | G | T | R | V
